# Altium schematic sheet Buzzer.SchDoc: Buzzer
size 215 x 139 mm; DrawnBy: Kace Chandler; DocumentNumber: 17; SheetNumber: 17; SheetTotal: 23
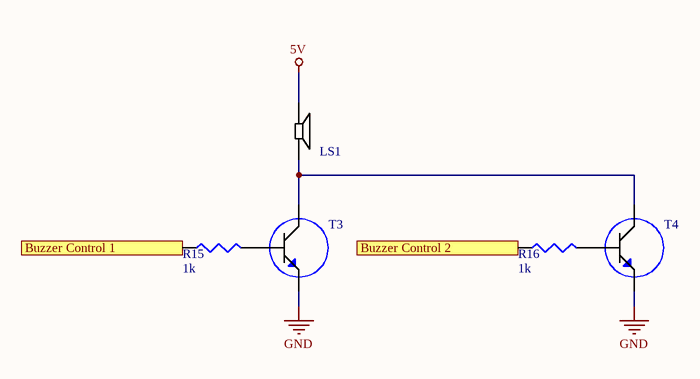
[diagram p0: Buzzer.SchDoc]

## Parts
LS1  CT-1205C-SMT  [CUI_CT-1205C-SMT]  (value not drawn)
R15  value 1k  (hidden comment: Res3)
R16  value 1k  (hidden comment: Res3)
T3  MMBT2222ALT1  [BJT]  (value not drawn)
T4  MMBT2222ALT1  [BJT]  (value not drawn)

## Ports
Buzzer Control 1 (in), Buzzer Control 2 (in)

## Nets
5V: LS1.2
GND: T3.2(E) T4.2(E)
Buzzer Control 1: R15.1 ; port Buzzer Control 1
Buzzer Control 2: R16.1 ; port Buzzer Control 2
NetLS1_1: LS1.1 T3.3(C) T4.3(C)
NetR15_2: R15.2 T3.1(B)
NetR16_2: R16.2 T4.1(B)

## Library data of the parts
LS1 = Buzzer: MF: CUI Inc.; MP: CT-1205C-SMT-TR; Availability: Unavailable; SnapEDA_Link: https://www.snapeda.com/parts/CT-1205C-SMT-TR/CUI%20Inc./view-part/?ref=snap; Package: CUI; Price: None; Value: *; Supplier 1: Digi-Key; Supplier Part Number 1: 102-1200-1-ND
R15 R16 = Res3: Resistor; Published: 8-Jun-2000; LatestRevisionDate: 29-May-2009; LatestRevisionNote: IPC-7351 Footprint Added.; PackageReference: J1-0603; Publisher: Altium Limited; PackageDescription: Chip Resistor
T3 T4 = BJT NPN: Trans NPN 40V 0.6A SOT23; MF: ON Semiconductor; SnapEDA_Link: https://www.snapeda.com/parts/MMBT2222ALT1/ON%20Semiconductor/view-part/?ref=snap; Price: None; Availability: Unavailable; MP: MMBT2222ALT1; Package: SOT-23 Motorola; Value: *; Supplier 1: Digi-Key; Supplier Part Number 1: MMBT2222ATPMSCT-ND